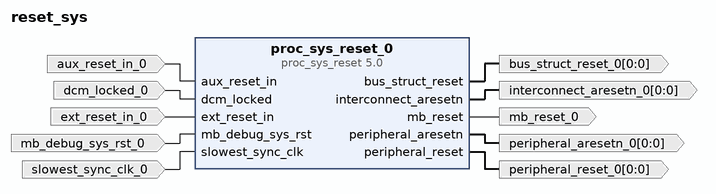
[diagram p0: block diagram of the top level]
# Vivado block design reset_sys, xc7z010clg400-1, Vivado 2018.3
create_bd_design reset_sys

create_bd_port -dir I -type rst aux_reset_in_0
create_bd_port -dir O -from 0 -to 0 -type rst bus_struct_reset_0
create_bd_port -dir I dcm_locked_0
create_bd_port -dir I -type rst ext_reset_in_0
create_bd_port -dir O -from 0 -to 0 -type rst interconnect_aresetn_0
create_bd_port -dir I -type rst mb_debug_sys_rst_0
set_property -dict {CONFIG.POLARITY ACTIVE_HIGH} [get_bd_ports mb_debug_sys_rst_0]
create_bd_port -dir O -type rst mb_reset_0
create_bd_port -dir O -from 0 -to 0 -type rst peripheral_aresetn_0
create_bd_port -dir O -from 0 -to 0 -type rst peripheral_reset_0
create_bd_port -dir I -type clk slowest_sync_clk_0

create_bd_cell -type ip -vlnv xilinx.com:ip:proc_sys_reset:5.0 proc_sys_reset_0

# ---- connections ----

connect_bd_net -net aux_reset_in_0_1 [get_bd_ports aux_reset_in_0] [get_bd_pins proc_sys_reset_0/aux_reset_in]
connect_bd_net [get_bd_pins proc_sys_reset_0/bus_struct_reset] [get_bd_ports bus_struct_reset_0]
connect_bd_net -net dcm_locked_0_1 [get_bd_ports dcm_locked_0] [get_bd_pins proc_sys_reset_0/dcm_locked]
connect_bd_net -net ext_reset_in_0_1 [get_bd_ports ext_reset_in_0] [get_bd_pins proc_sys_reset_0/ext_reset_in]
connect_bd_net [get_bd_pins proc_sys_reset_0/interconnect_aresetn] [get_bd_ports interconnect_aresetn_0]
connect_bd_net -net mb_debug_sys_rst_0_1 [get_bd_ports mb_debug_sys_rst_0] [get_bd_pins proc_sys_reset_0/mb_debug_sys_rst]
connect_bd_net [get_bd_pins proc_sys_reset_0/mb_reset] [get_bd_ports mb_reset_0]
connect_bd_net [get_bd_pins proc_sys_reset_0/peripheral_aresetn] [get_bd_ports peripheral_aresetn_0]
connect_bd_net [get_bd_pins proc_sys_reset_0/peripheral_reset] [get_bd_ports peripheral_reset_0]
connect_bd_net -net slowest_sync_clk_0_1 [get_bd_ports slowest_sync_clk_0] [get_bd_pins proc_sys_reset_0/slowest_sync_clk]

validate_bd_design
save_bd_design
